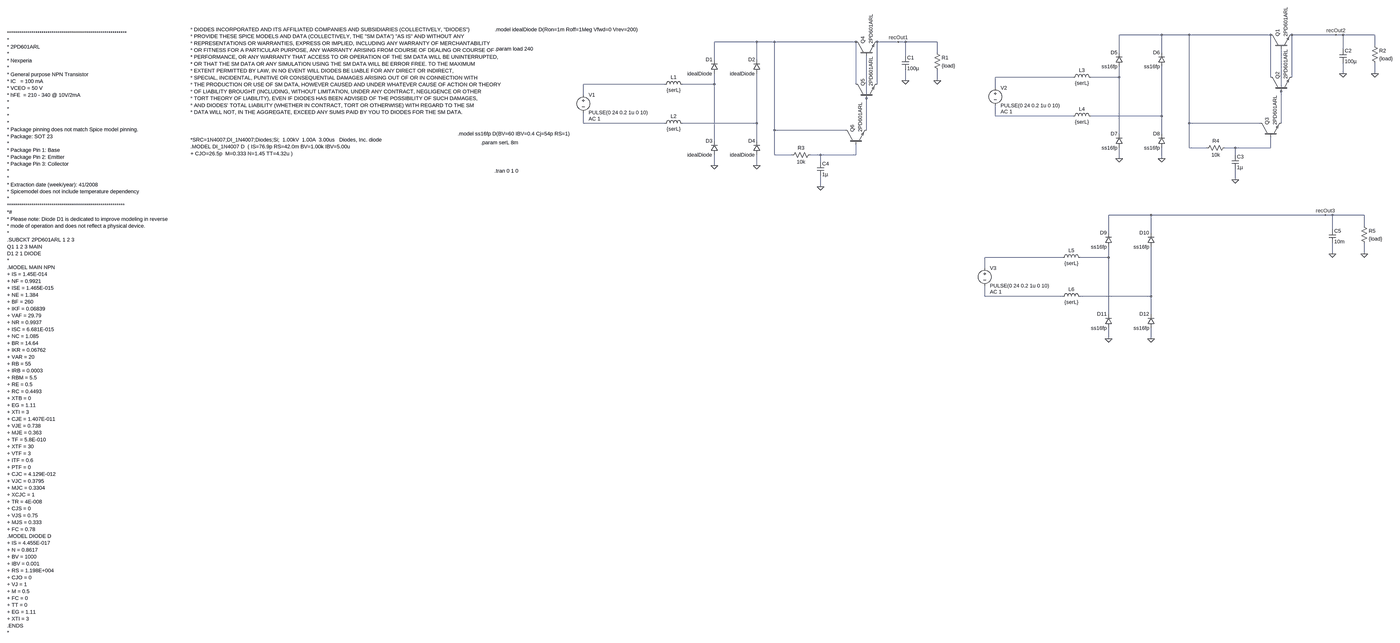
[diagram p0: schematic supply.asc, whole sheet]
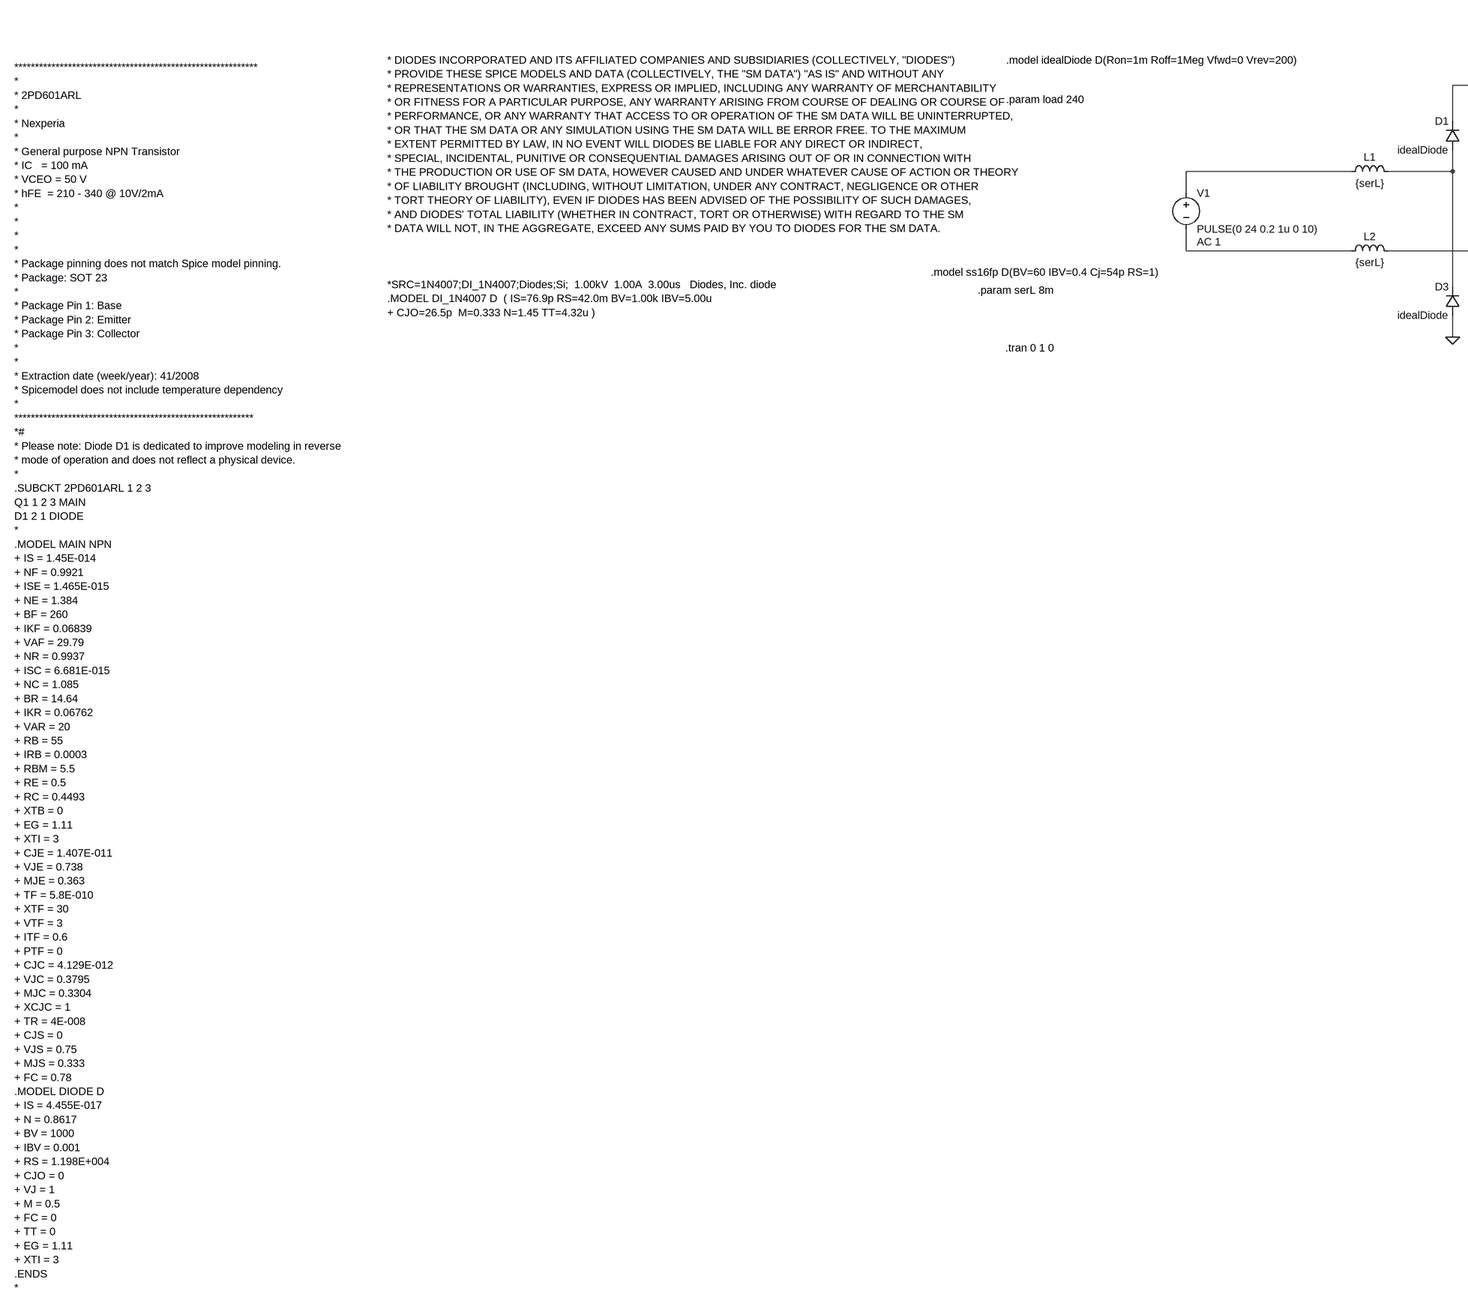
[diagram p1: schematic supply.asc, part, row 1 of 1, column 1 of 2]
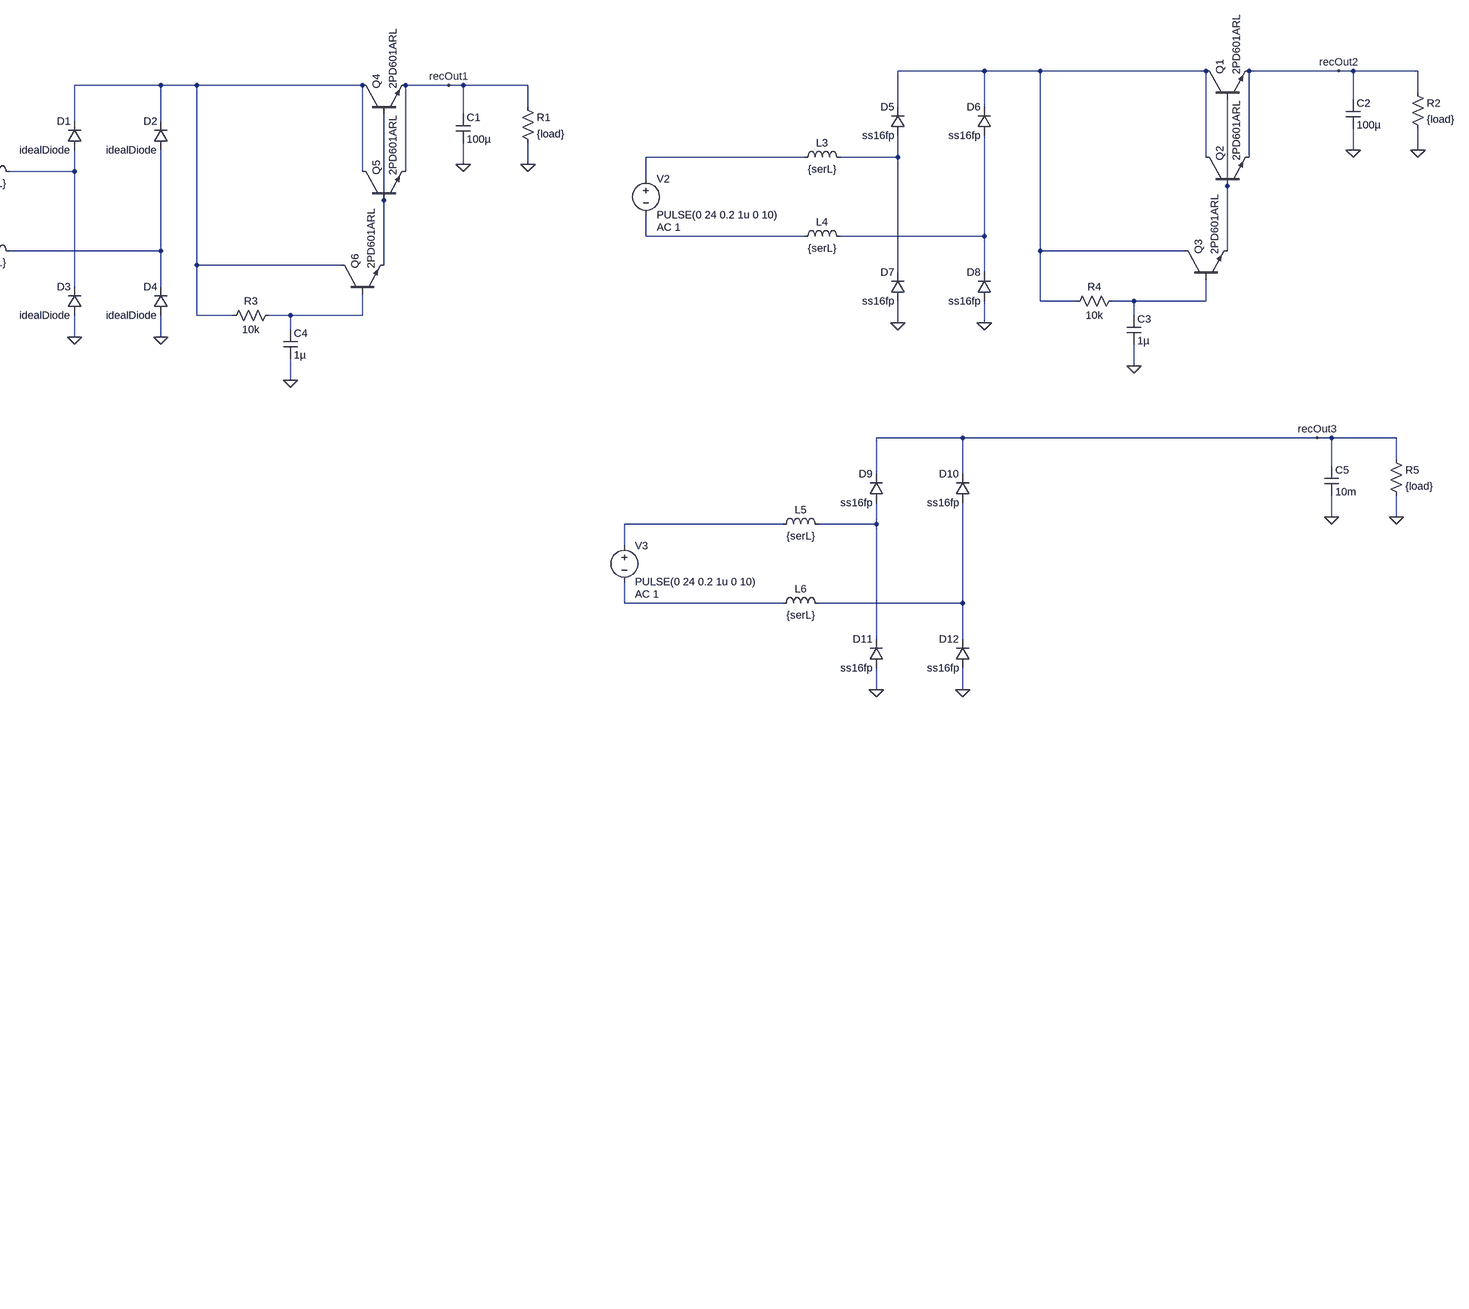
[diagram p2: schematic supply.asc, part, row 1 of 1, column 2 of 2]
supply.asc, the LTspice schematic file:
Version 4
SHEET 1 4452 2268
WIRE 2384 -176 2192 -176
WIRE 2512 -176 2384 -176
WIRE 2880 -176 2512 -176
WIRE 3232 -176 2976 -176
WIRE 3264 -176 3232 -176
WIRE 3408 -176 3264 -176
WIRE 352 -144 160 -144
WIRE 432 -144 352 -144
WIRE 800 -144 432 -144
WIRE 992 -144 896 -144
WIRE 1024 -144 992 -144
WIRE 1168 -144 1024 -144
WIRE 3408 -128 3408 -176
WIRE 3264 -112 3264 -176
WIRE 1168 -96 1168 -144
WIRE 2192 -96 2192 -176
WIRE 2384 -96 2384 -176
WIRE 1024 -80 1024 -144
WIRE 160 -64 160 -144
WIRE 352 -64 352 -144
WIRE 3264 0 3264 -48
WIRE 3408 0 3408 -48
WIRE 1984 16 1632 16
WIRE 2192 16 2192 -32
WIRE 2192 16 2064 16
WIRE 2880 16 2880 -176
WIRE 2976 16 2976 -176
WIRE 1024 32 1024 -16
WIRE 1168 32 1168 -16
WIRE -64 48 -432 48
WIRE 160 48 160 0
WIRE 160 48 16 48
WIRE 800 48 800 -144
WIRE 896 48 896 -144
WIRE 1632 64 1632 16
WIRE 2928 80 2928 -112
WIRE -432 96 -432 48
WIRE 848 112 848 -80
WIRE 1632 192 1632 144
WIRE 1984 192 1632 192
WIRE 2384 192 2384 -32
WIRE 2384 192 2064 192
WIRE -432 224 -432 176
WIRE -64 224 -432 224
WIRE 352 224 352 0
WIRE 352 224 16 224
WIRE 2512 224 2512 -176
WIRE 2832 224 2512 224
WIRE 2928 224 2928 80
WIRE 432 256 432 -144
WIRE 752 256 432 256
WIRE 848 256 848 112
WIRE 2192 272 2192 16
WIRE 2384 272 2384 192
WIRE 160 304 160 48
WIRE 352 304 352 224
WIRE 2512 336 2512 224
WIRE 2592 336 2512 336
WIRE 2720 336 2672 336
WIRE 2880 336 2880 288
WIRE 2880 336 2720 336
WIRE 432 368 432 256
WIRE 512 368 432 368
WIRE 640 368 592 368
WIRE 800 368 800 320
WIRE 800 368 640 368
WIRE 2720 368 2720 336
WIRE 2192 384 2192 336
WIRE 2384 384 2384 336
WIRE 640 400 640 368
WIRE 160 416 160 368
WIRE 352 416 352 368
WIRE 2720 480 2720 432
WIRE 640 512 640 464
WIRE 2336 640 2144 640
WIRE 3184 640 2336 640
WIRE 3216 640 3184 640
WIRE 3360 640 3216 640
WIRE 3360 688 3360 640
WIRE 3216 704 3216 640
WIRE 2144 720 2144 640
WIRE 2336 720 2336 640
WIRE 3216 816 3216 768
WIRE 3360 816 3360 768
WIRE 1936 832 1584 832
WIRE 2144 832 2144 784
WIRE 2144 832 2016 832
WIRE 1584 880 1584 832
WIRE 1584 1008 1584 960
WIRE 1936 1008 1584 1008
WIRE 2336 1008 2336 784
WIRE 2336 1008 2016 1008
WIRE 2144 1088 2144 832
WIRE 2336 1088 2336 1008
WIRE 2144 1200 2144 1152
WIRE 2336 1200 2336 1152
FLAG 160 416 0
FLAG 352 416 0
FLAG 992 -144 recOut1
FLAG 1168 32 0
FLAG 1024 32 0
FLAG 2192 384 0
FLAG 2384 384 0
FLAG 3232 -176 recOut2
FLAG 3408 0 0
FLAG 3264 0 0
FLAG 2720 480 0
FLAG 640 512 0
FLAG 2144 1200 0
FLAG 2336 1200 0
FLAG 3184 640 recOut3
FLAG 3360 816 0
FLAG 3216 816 0
SYMBOL voltage -432 80 R0
WINDOW 123 24 124 Left 2
WINDOW 39 0 0 Left 0
SYMATTR InstName V1
SYMATTR Value PULSE(0 24 0.2 1u 0 10)
SYMATTR Value2 AC 1
SYMBOL diode 176 0 R180
WINDOW 0 24 64 Left 2
WINDOW 3 24 0 Left 2
SYMATTR InstName D1
SYMATTR Value idealDiode
SYMBOL diode 368 0 R180
WINDOW 0 24 64 Left 2
WINDOW 3 24 0 Left 2
SYMATTR InstName D2
SYMATTR Value idealDiode
SYMBOL diode 176 368 R180
WINDOW 0 24 64 Left 2
WINDOW 3 24 0 Left 2
SYMATTR InstName D3
SYMATTR Value idealDiode
SYMBOL diode 368 368 R180
WINDOW 0 24 64 Left 2
WINDOW 3 24 0 Left 2
SYMATTR InstName D4
SYMATTR Value idealDiode
SYMBOL res 1152 -112 R0
SYMATTR InstName R1
SYMATTR Value {load}
SYMBOL cap 1008 -80 R0
SYMATTR InstName C1
SYMATTR Value 100µ
SYMBOL voltage 1632 48 R0
WINDOW 123 24 124 Left 2
WINDOW 39 0 0 Left 0
SYMATTR InstName V2
SYMATTR Value PULSE(0 24 0.2 1u 0 10)
SYMATTR Value2 AC 1
SYMBOL diode 2208 -32 R180
WINDOW 0 24 64 Left 2
WINDOW 3 24 0 Left 2
SYMATTR InstName D5
SYMATTR Value ss16fp
SYMBOL diode 2400 -32 R180
WINDOW 0 24 64 Left 2
WINDOW 3 24 0 Left 2
SYMATTR InstName D6
SYMATTR Value ss16fp
SYMBOL diode 2208 336 R180
WINDOW 0 24 64 Left 2
WINDOW 3 24 0 Left 2
SYMATTR InstName D7
SYMATTR Value ss16fp
SYMBOL diode 2400 336 R180
WINDOW 0 24 64 Left 2
WINDOW 3 24 0 Left 2
SYMATTR InstName D8
SYMATTR Value ss16fp
SYMBOL res 3392 -144 R0
SYMATTR InstName R2
SYMATTR Value {load}
SYMBOL cap 3248 -112 R0
SYMATTR InstName C2
SYMATTR Value 100µ
SYMBOL ind -80 64 R270
WINDOW 0 32 56 VTop 2
WINDOW 3 5 56 VBottom 2
SYMATTR InstName L1
SYMATTR Value {serL}
SYMBOL ind -80 240 R270
WINDOW 0 32 56 VTop 2
WINDOW 3 5 56 VBottom 2
SYMATTR InstName L2
SYMATTR Value {serL}
SYMBOL ind 1968 32 R270
WINDOW 0 32 56 VTop 2
WINDOW 3 5 56 VBottom 2
SYMATTR InstName L3
SYMATTR Value {serL}
SYMBOL ind 1968 208 R270
WINDOW 0 32 56 VTop 2
WINDOW 3 5 56 VBottom 2
SYMATTR InstName L4
SYMATTR Value {serL}
SYMBOL res 2688 320 R90
WINDOW 0 0 56 VBottom 2
WINDOW 3 32 56 VTop 2
SYMATTR InstName R4
SYMATTR Value 10k
SYMBOL npn 2832 288 R270
SYMATTR InstName Q3
SYMATTR Value 2PD601ARL
SYMATTR Prefix X
SYMBOL cap 2704 368 R0
SYMATTR InstName C3
SYMATTR Value 1µ
SYMBOL res 608 352 R90
WINDOW 0 0 56 VBottom 2
WINDOW 3 32 56 VTop 2
SYMATTR InstName R3
SYMATTR Value 10k
SYMBOL cap 624 400 R0
SYMATTR InstName C4
SYMATTR Value 1µ
SYMBOL npn 2880 -112 R270
SYMATTR InstName Q1
SYMATTR Value 2PD601ARL
SYMATTR Prefix X
SYMBOL npn 2880 80 R270
SYMATTR InstName Q2
SYMATTR Value 2PD601ARL
SYMATTR Prefix X
SYMBOL npn 800 -80 R270
SYMATTR InstName Q4
SYMATTR Value 2PD601ARL
SYMATTR Prefix X
SYMBOL npn 800 112 R270
SYMATTR InstName Q5
SYMATTR Value 2PD601ARL
SYMATTR Prefix X
SYMBOL npn 752 320 R270
SYMATTR InstName Q6
SYMATTR Value 2PD601ARL
SYMATTR Prefix X
SYMBOL voltage 1584 864 R0
WINDOW 123 24 124 Left 2
WINDOW 39 0 0 Left 0
SYMATTR InstName V3
SYMATTR Value PULSE(0 24 0.2 1u 0 10)
SYMATTR Value2 AC 1
SYMBOL diode 2160 784 R180
WINDOW 0 24 64 Left 2
WINDOW 3 24 0 Left 2
SYMATTR InstName D9
SYMATTR Value ss16fp
SYMBOL diode 2352 784 R180
WINDOW 0 24 64 Left 2
WINDOW 3 24 0 Left 2
SYMATTR InstName D10
SYMATTR Value ss16fp
SYMBOL diode 2160 1152 R180
WINDOW 0 24 64 Left 2
WINDOW 3 24 0 Left 2
SYMATTR InstName D11
SYMATTR Value ss16fp
SYMBOL diode 2352 1152 R180
WINDOW 0 24 64 Left 2
WINDOW 3 24 0 Left 2
SYMATTR InstName D12
SYMATTR Value ss16fp
SYMBOL res 3344 672 R0
SYMATTR InstName R5
SYMATTR Value {load}
SYMBOL cap 3200 704 R0
SYMATTR InstName C5
SYMATTR Value 10m
SYMBOL ind 1920 848 R270
WINDOW 0 32 56 VTop 2
WINDOW 3 5 56 VBottom 2
SYMATTR InstName L5
SYMATTR Value {serL}
SYMBOL ind 1920 1024 R270
WINDOW 0 32 56 VTop 2
WINDOW 3 5 56 VBottom 2
SYMATTR InstName L6
SYMATTR Value {serL}
TEXT -832 -200 Left 2 !.model idealDiode D(Ron=1m Roff=1Meg Vfwd=0 Vrev=200)
TEXT -834 440 Left 2 !.tran 0 1 0
TEXT -832 -112 Left 2 !.param load 240
TEXT -2208 -200 Left 2 !* DIODES INCORPORATED AND ITS AFFILIATED COMPANIES AND SUBSIDIARIES (COLLECTIVELY, "DIODES") \n* PROVIDE THESE SPICE MODELS AND DATA (COLLECTIVELY, THE "SM DATA") "AS IS" AND WITHOUT ANY \n* REPRESENTATIONS OR WARRANTIES, EXPRESS OR IMPLIED, INCLUDING ANY WARRANTY OF MERCHANTABILITY \n* OR FITNESS FOR A PARTICULAR PURPOSE, ANY WARRANTY ARISING FROM COURSE OF DEALING OR COURSE OF \n* PERFORMANCE, OR ANY WARRANTY THAT ACCESS TO OR OPERATION OF THE SM DATA WILL BE UNINTERRUPTED, \n* OR THAT THE SM DATA OR ANY SIMULATION USING THE SM DATA WILL BE ERROR FREE. TO THE MAXIMUM \n* EXTENT PERMITTED BY LAW, IN NO EVENT WILL DIODES BE LIABLE FOR ANY DIRECT OR INDIRECT, \n* SPECIAL, INCIDENTAL, PUNITIVE OR CONSEQUENTIAL DAMAGES ARISING OUT OF OR IN CONNECTION WITH \n* THE PRODUCTION OR USE OF SM DATA, HOWEVER CAUSED AND UNDER WHATEVER CAUSE OF ACTION OR THEORY \n* OF LIABILITY BROUGHT (INCLUDING, WITHOUT LIMITATION, UNDER ANY CONTRACT, NEGLIGENCE OR OTHER \n* TORT THEORY OF LIABILITY), EVEN IF DIODES HAS BEEN ADVISED OF THE POSSIBILITY OF SUCH DAMAGES, \n* AND DIODES' TOTAL LIABILITY (WHETHER IN CONTRACT, TORT OR OTHERWISE) WITH REGARD TO THE SM \n* DATA WILL NOT, IN THE AGGREGATE, EXCEED ANY SUMS PAID BY YOU TO DIODES FOR THE SM DATA.\n \n \n \n*SRC=1N4007;DI_1N4007;Diodes;Si;  1.00kV  1.00A  3.00us   Diodes, Inc. diode\n.MODEL DI_1N4007 D  ( IS=76.9p RS=42.0m BV=1.00k IBV=5.00u\n+ CJO=26.5p  M=0.333 N=1.45 TT=4.32u )
TEXT -1000 272 Left 2 !.model ss16fp D(BV=60 IBV=0.4 Cj=54p RS=1)
TEXT -896 312 Left 2 !.param serL 8m
TEXT -3144 -184 Left 2 !***********************************************************\n*\n* 2PD601ARL\n*\n* Nexperia\n*\n* General purpose NPN Transistor\n* IC   = 100 mA\n* VCEO = 50 V \n* hFE  = 210 - 340 @ 10V/2mA\n*\n*\n*\n*\n* Package pinning does not match Spice model pinning.\n* Package: SOT 23\n* \n* Package Pin 1: Base\n* Package Pin 2: Emitter\n* Package Pin 3: Collector\n*\n*\n* Extraction date (week/year): 41/2008  \n* Spicemodel does not include temperature dependency\n*\n**********************************************************\n*#\n* Please note: Diode D1 is dedicated to improve modeling in reverse\n* mode of operation and does not reflect a physical device.\n*\n.SUBCKT 2PD601ARL 1 2 3\nQ1 1 2 3 MAIN\nD1 2 1 DIODE\n*\n.MODEL MAIN NPN \n+ IS = 1.45E-014 \n+ NF = 0.9921 \n+ ISE = 1.465E-015 \n+ NE = 1.384 \n+ BF = 260 \n+ IKF = 0.06839 \n+ VAF = 29.79 \n+ NR = 0.9937 \n+ ISC = 6.681E-015 \n+ NC = 1.085 \n+ BR = 14.64 \n+ IKR = 0.06762 \n+ VAR = 20 \n+ RB = 55 \n+ IRB = 0.0003 \n+ RBM = 5.5 \n+ RE = 0.5 \n+ RC = 0.4493 \n+ XTB = 0 \n+ EG = 1.11 \n+ XTI = 3 \n+ CJE = 1.407E-011 \n+ VJE = 0.738 \n+ MJE = 0.363 \n+ TF = 5.8E-010 \n+ XTF = 30 \n+ VTF = 3 \n+ ITF = 0.6 \n+ PTF = 0 \n+ CJC = 4.129E-012 \n+ VJC = 0.3795 \n+ MJC = 0.3304 \n+ XCJC = 1 \n+ TR = 4E-008 \n+ CJS = 0 \n+ VJS = 0.75 \n+ MJS = 0.333 \n+ FC = 0.78 \n.MODEL DIODE D \n+ IS = 4.455E-017 \n+ N = 0.8617 \n+ BV = 1000 \n+ IBV = 0.001 \n+ RS = 1.198E+004 \n+ CJO = 0 \n+ VJ = 1 \n+ M = 0.5 \n+ FC = 0 \n+ TT = 0 \n+ EG = 1.11 \n+ XTI = 3 \n.ENDS\n*

The netlist it stands for:
* supply.asc
V1 N005 N011 PULSE(0 24 0.2 1u 0 10) AC 1
D1 N006 N002 idealDiode
D2 N012 N002 idealDiode
D3 0 N006 idealDiode
D4 0 N012 idealDiode
R1 recOut1 0 {load}
C1 recOut1 0 100µ
V2 N003 N009 PULSE(0 24 0.2 1u 0 10) AC 1
D5 N004 N001 ss16fp
D6 N010 N001 ss16fp
D7 0 N004 ss16fp
D8 0 N010 ss16fp
R2 recOut2 0 {load}
C2 recOut2 0 100µ
L1 N005 N006 {serL}
L2 N011 N012 {serL}
L3 N003 N004 {serL}
L4 N009 N010 {serL}
R4 N013 N001 10k
XQ3 N001 N013 N007 2PD601ARL  ; pins C B E
C3 N013 0 1µ
R3 N014 N002 10k
C4 N014 0 1µ
XQ1 N001 N007 recOut2 2PD601ARL  ; pins C B E
XQ2 N001 N007 recOut2 2PD601ARL  ; pins C B E
XQ4 N002 N008 recOut1 2PD601ARL  ; pins C B E
XQ5 N002 N008 recOut1 2PD601ARL  ; pins C B E
XQ6 N002 N014 N008 2PD601ARL  ; pins C B E
V3 N015 N017 PULSE(0 24 0.2 1u 0 10) AC 1
D9 N016 recOut3 ss16fp
D10 N018 recOut3 ss16fp
D11 0 N016 ss16fp
D12 0 N018 ss16fp
R5 recOut3 0 {load}
C5 recOut3 0 10m
L5 N015 N016 {serL}
L6 N017 N018 {serL}
.model D D
.lib standard.dio
.model idealDiode D(Ron=1m Roff=1Meg Vfwd=0 Vrev=200)
.tran 0 1 0
.param load 240
* DIODES INCORPORATED AND ITS AFFILIATED COMPANIES AND SUBSIDIARIES (COLLECTIVELY, "DIODES")
* PROVIDE THESE SPICE MODELS AND DATA (COLLECTIVELY, THE "SM DATA") "AS IS" AND WITHOUT ANY
* REPRESENTATIONS OR WARRANTIES, EXPRESS OR IMPLIED, INCLUDING ANY WARRANTY OF MERCHANTABILITY
* OR FITNESS FOR A PARTICULAR PURPOSE, ANY WARRANTY ARISING FROM COURSE OF DEALING OR COURSE OF
* PERFORMANCE, OR ANY WARRANTY THAT ACCESS TO OR OPERATION OF THE SM DATA WILL BE UNINTERRUPTED,
* OR THAT THE SM DATA OR ANY SIMULATION USING THE SM DATA WILL BE ERROR FREE. TO THE MAXIMUM
* EXTENT PERMITTED BY LAW, IN NO EVENT WILL DIODES BE LIABLE FOR ANY DIRECT OR INDIRECT,
* SPECIAL, INCIDENTAL, PUNITIVE OR CONSEQUENTIAL DAMAGES ARISING OUT OF OR IN CONNECTION WITH
* THE PRODUCTION OR USE OF SM DATA, HOWEVER CAUSED AND UNDER WHATEVER CAUSE OF ACTION OR THEORY
* OF LIABILITY BROUGHT (INCLUDING, WITHOUT LIMITATION, UNDER ANY CONTRACT, NEGLIGENCE OR OTHER
* TORT THEORY OF LIABILITY), EVEN IF DIODES HAS BEEN ADVISED OF THE POSSIBILITY OF SUCH DAMAGES,
* AND DIODES' TOTAL LIABILITY (WHETHER IN CONTRACT, TORT OR OTHERWISE) WITH REGARD TO THE SM
* DATA WILL NOT, IN THE AGGREGATE, EXCEED ANY SUMS PAID BY YOU TO DIODES FOR THE SM DATA.
*SRC=1N4007;DI_1N4007;Diodes;Si;  1.00kV  1.00A  3.00us   Diodes, Inc. diode
.MODEL DI_1N4007 D  ( IS=76.9p RS=42.0m BV=1.00k IBV=5.00u
+ CJO=26.5p  M=0.333 N=1.45 TT=4.32u )
.model ss16fp D(BV=60 IBV=0.4 Cj=54p RS=1)
.param serL 8m
***********************************************************
*
* 2PD601ARL
*
* Nexperia
*
* General purpose NPN Transistor
* IC   = 100 mA
* VCEO = 50 V
* hFE  = 210 - 340 @ 10V/2mA
*
*
*
*
* Package pinning does not match Spice model pinning.
* Package: SOT 23
*
* Package Pin 1: Base
* Package Pin 2: Emitter
* Package Pin 3: Collector
*
*
* Extraction date (week/year): 41/2008
* Spicemodel does not include temperature dependency
*
**********************************************************
*#
* Please note: Diode D1 is dedicated to improve modeling in reverse
* mode of operation and does not reflect a physical device.
*
.SUBCKT 2PD601ARL 1 2 3
Q1 1 2 3 MAIN
D1 2 1 DIODE
*
.MODEL MAIN NPN
+ IS = 1.45E-014
+ NF = 0.9921
+ ISE = 1.465E-015
+ NE = 1.384
+ BF = 260
+ IKF = 0.06839
+ VAF = 29.79
+ NR = 0.9937
+ ISC = 6.681E-015
+ NC = 1.085
+ BR = 14.64
+ IKR = 0.06762
+ VAR = 20
+ RB = 55
+ IRB = 0.0003
+ RBM = 5.5
+ RE = 0.5
+ RC = 0.4493
+ XTB = 0
+ EG = 1.11
+ XTI = 3
+ CJE = 1.407E-011
+ VJE = 0.738
+ MJE = 0.363
+ TF = 5.8E-010
+ XTF = 30
+ VTF = 3
+ ITF = 0.6
+ PTF = 0
+ CJC = 4.129E-012
+ VJC = 0.3795
+ MJC = 0.3304
+ XCJC = 1
+ TR = 4E-008
+ CJS = 0
+ VJS = 0.75
+ MJS = 0.333
+ FC = 0.78
.MODEL DIODE D
+ IS = 4.455E-017
+ N = 0.8617
+ BV = 1000
+ IBV = 0.001
+ RS = 1.198E+004
+ CJO = 0
+ VJ = 1
+ M = 0.5
+ FC = 0
+ TT = 0
+ EG = 1.11
+ XTI = 3
.ENDS
*
.backanno
.end